# Altium schematic sheet Smartwatch_Display.SchDoc
size A4; SheetNumber: 4; SheetTotal: 4
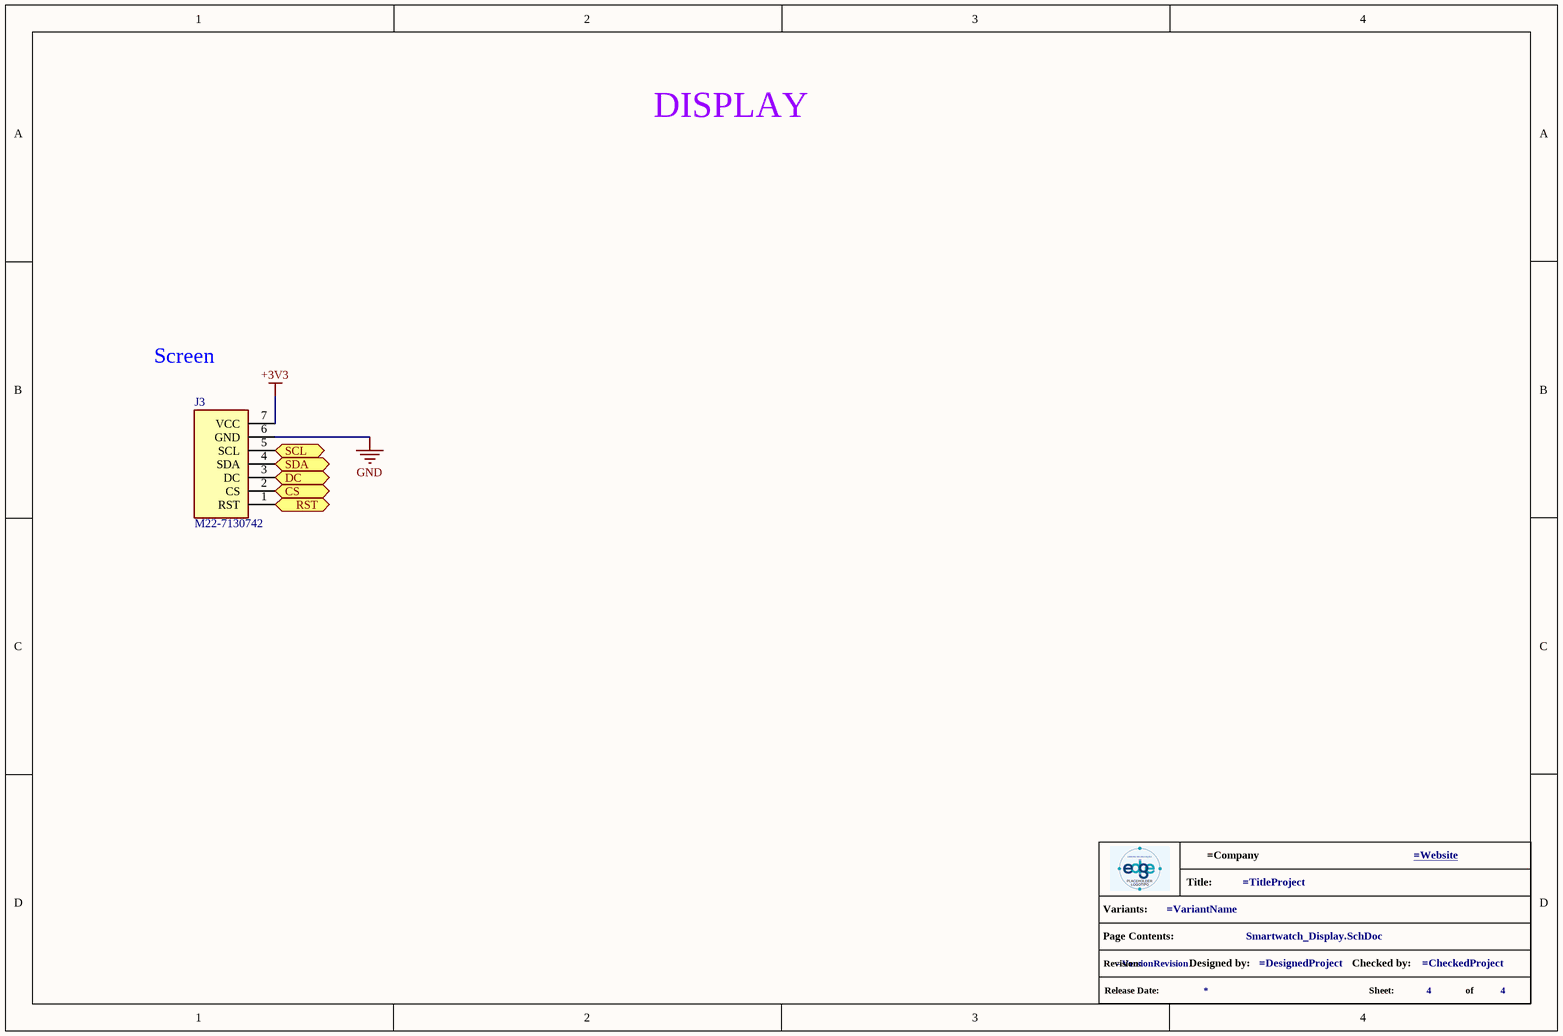
[diagram p0: Smartwatch_Display.SchDoc]

## Parts
*?  info_project  (value not drawn)  (graphical)
J3  M22-7130742  [SHDR7W50P0X200_1X7_1450X240X440P]

## Ports
CS (bidir, see 3[2C]), DC (bidir, see 3[2C]), RST (bidir, see 3[2C]), SCL (bidir, see 3[2C]), SDA (bidir, see 3[2C])

## Nets
+3V3: J3.7(VCC)
GND: J3.6(GND)
CS: J3.2(CS) ; port CS
DC: J3.3(DC) ; port DC
RST: J3.1(RST) ; port RST
SCL: J3.5(SCL) ; port SCL
SDA: J3.4(SDA) ; port SDA

## Notes on the sheet
- DISPLAY
- Screen
- (in symbol info_project) Title:; Variants:; Page Contents:; Revision:; Designed by:; Checked by:; Release Date:; Sheet:; of

## Library data of the parts
J3 = M22-7130742: Connector; Manufacturer_Name: Harwin; Datasheet Link: https://cdn.harwin.com/pdfs/M22-713.pdf; Height: 4.4mm; Manufacturer_Part_Number: M22-7130742; Mouser Part Number: 855-M22-7130742; Mouser Price/Stock: https://www.mouser.co.uk/ProductDetail/Harwin/M22-7130742?qs=ulE8k0yEMYatGybRLMpABg%3D%3D